# Altium schematic sheet BUF_ADC.SchDoc
size A4; SheetNumber: 8; SheetTotal: 9
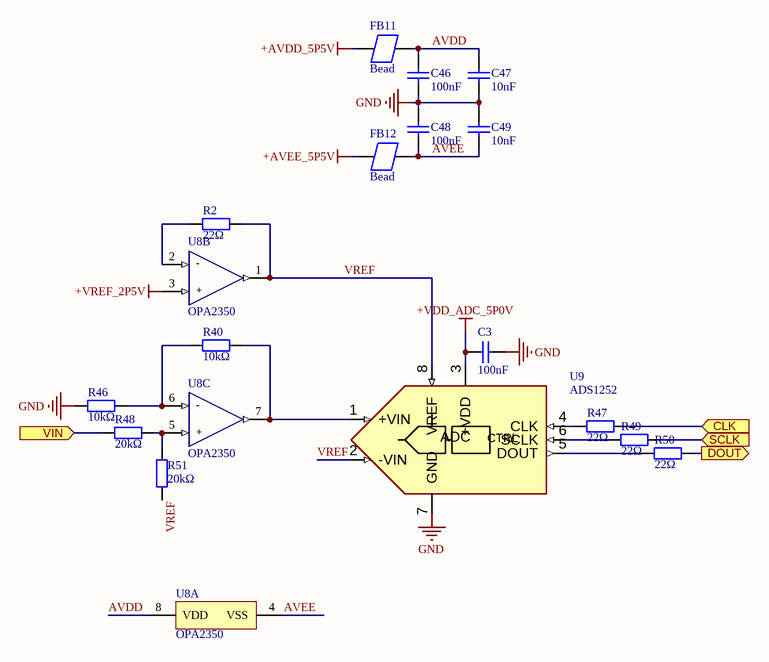
[diagram p0: BUF_ADC.SchDoc]

## Parts
C3  100nF  [0603_C]
C46  100nF  [0603_C]
C47  10nF  [0603_C]
C48  100nF  [0603_C]
C49  10nF  [0603_C]
FB11  Bead  [0805_L]
FB12  Bead  [0805_L]
R2  22Ω  [0603_R]
R40  10kΩ  [0603_R]
R46  10kΩ  [0603_R]
R47  22Ω  [0603_R]
R48  20kΩ  [0603_R]
R49  22Ω  [0603_R]
R50  22Ω  [0603_R]
R51  20kΩ  [0603_R]
U8  OPA2350  [SOIC127P600X175-8M]  (parts A,B,C of 3)
U9  ADS1252  [SOIC127P600X175-8M]

## Ports
CLK (in), DOUT (out), SCLK (in), VIN (in)

## Nets
+AVDD_5P5V: FB11.1
+AVEE_5P5V: FB12.1
+VDD_ADC_5P0V: C3.1 U9.3(+VDD)
+VREF_2P5V: U8.3(+INA)
GND: C3.2 C46.1 C47.1 C48.1 C49.1 R46.1 U9.7(GND)
AVDD: C46.2 C47.2 FB11.2 U8.8(VDD)
AVEE: C48.2 C49.2 FB12.2 U8.4(VSS)
CLK: R47.2 ; port CLK
DOUT: R50.2 ; port DOUT
SCLK: R49.2 ; port SCLK
VIN: R48.1 ; port VIN
VREF: R2.2 R51.2 U8.1(OUTA) U9.2(-VIN) U9.8(VREF)
NetR2_1: R2.1 U8.2(-INA)
NetR40_1: R40.1 R46.2 U8.6(-INB)
NetR40_2: R40.2 U8.7(OUTB) U9.1(+VIN)
NetR47_1: R47.1 U9.4(CLK)
NetR48_2: R48.2 R51.1 U8.5(+INB)
NetR49_1: R49.1 U9.6(SCLK)
NetR50_1: R50.1 U9.5(DOUT)

## Notes on the sheet
- (in symbol ADS1252) ADC; CTRL
- (in symbol OPA2350, part B) -; +
- (in symbol OPA2350, part C) -; +

## Library data of the parts
C3 C46 C48 = 0603 100nF (104) 10% 50V: 贴片电容; ComponentLink1Description: 供应商链接; ComponentLink1URL: http://www.szlcsc.com/product/details_15331.html; Package: 0603; Supplier: LC; SuppliersPartNumber: C14663
C47 C49 = 0603 10nF (103) 10% 50V: 贴片电容; ComponentLink1Description: 供应商链接; ComponentLink1URL: http://www.szlcsc.com/product/details_58143.html; Package: 0603; Supplier: LC; SuppliersPartNumber: C57112
R2 R47 R49 R50 = 0603 22Ω (22R0) 1%: 贴片电阻; ComponentLink1Description: 供应商链接; ComponentLink1URL: http://www.szlcsc.com/product/details_24078.html; Package: 0603; Supplier: LC; SuppliersPartNumber: C23345
R40 R46 R48 R51 = 0603 10KΩ (1002) 1%: 贴片电阻; ComponentLink1Description: 供应商链接; ComponentLink1URL: http://www.szlcsc.com/product/details_26547.html; Package: 0603; Supplier: LC; SuppliersPartNumber: C25804
U8 = OPA2350: 10MHz RRIO Zero-Drift 5.5V